# Altium schematic sheet Altimeter.SchDoc
size A4; SheetNumber: 1; SheetTotal: 1
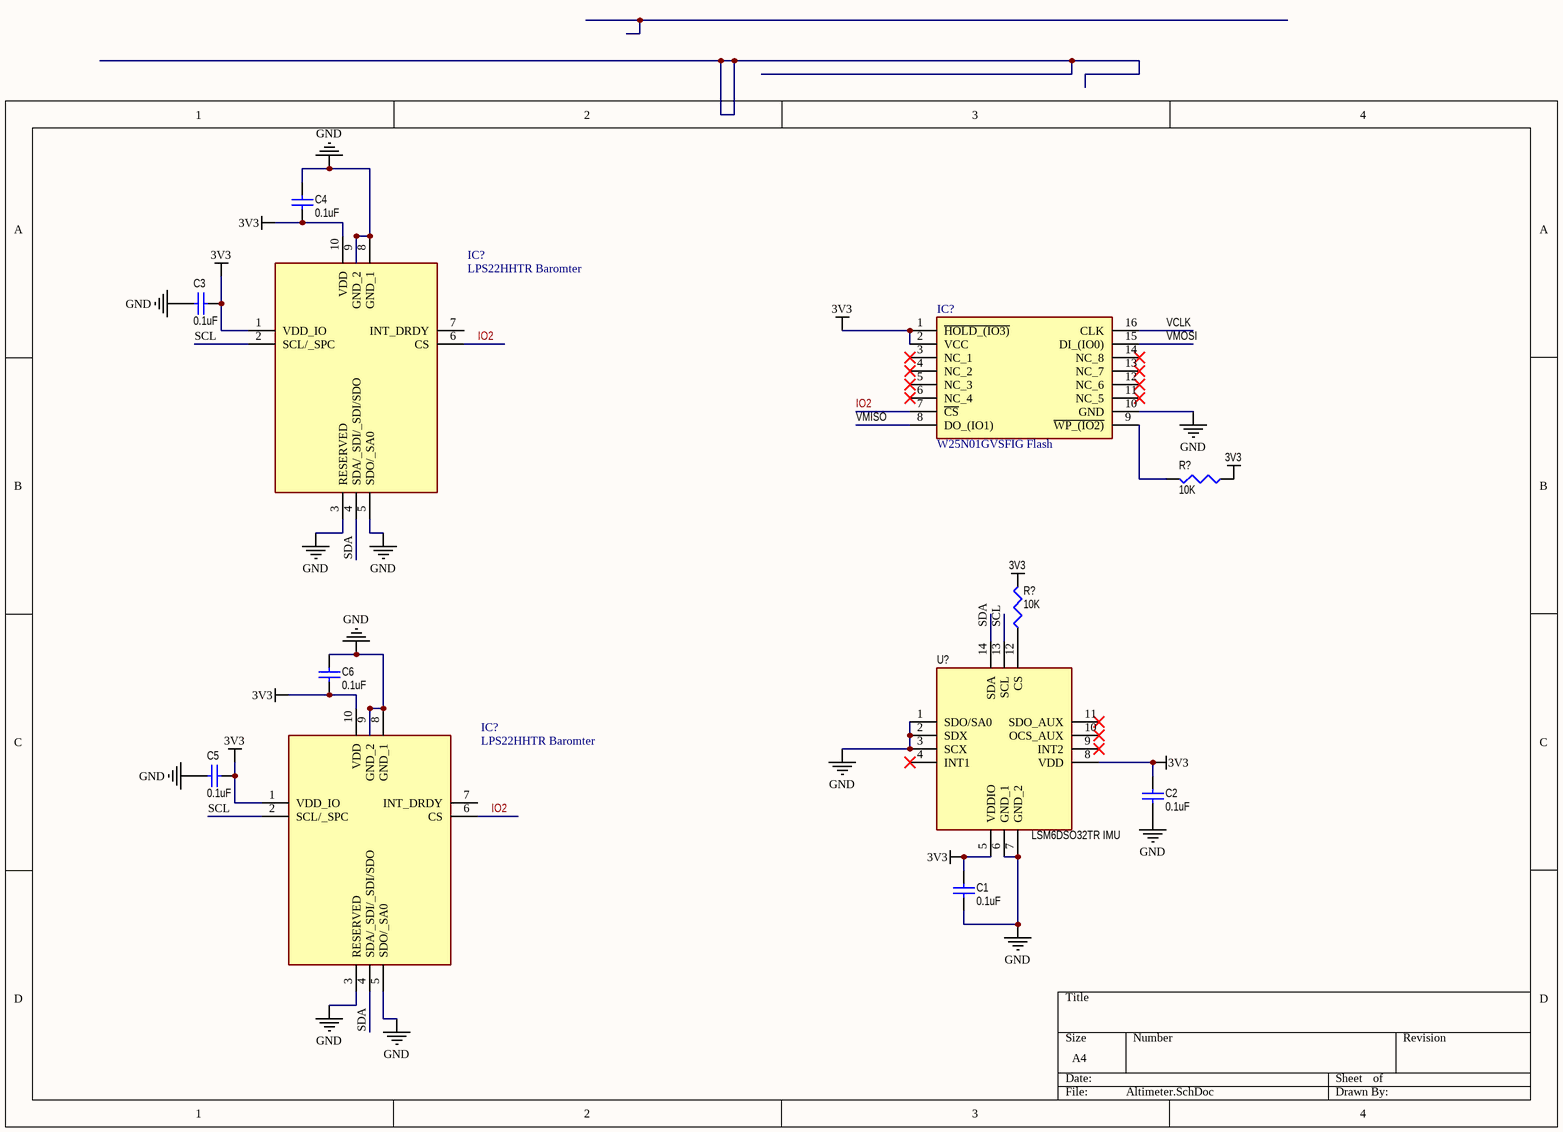
[diagram p0: Altimeter.SchDoc]

## Parts
(Parts that share a designator on the sheet are numbered #1, #2 ... from top to bottom, then left to right.)
C1  0.1uF  [1608[0603]]
C2  0.1uF  [1608[0603]]
C3  0.1uF  [1608[0603]]
C4  0.1uF  [1608[0603]]
C5  0.1uF  [1608[0603]]
C6  0.1uF  [1608[0603]]
IC?#1  LPS22HHTR Baromter  [LPS22HHTR]
IC?#2  W25N01GVSFIG Flash  [SOIC127P1032X264-16N]
IC?#3  LPS22HHTR Baromter  [LPS22HHTR]
R?#1  10K  [J1-0603]
R?#2  10K  [J1-0603]
U?  LSM6DSO32TR IMU  [LGA-14(2.5X3X0.86)]

## Nets
3V3: C1.2 C2.2 C3.2 C4.1 C5.1 C6.1 IC?#1.1(VDD_IO) IC?#1.10(VDD) IC?#2.1(~{HOLD_(IO3)}) IC?#2.2(VCC) IC?#3.1(VDD_IO) IC?#3.10(VDD) R?#1.1 U?.5(VDDIO) U?.8(VDD)
GND: C1.1 C2.1 C3.1 C4.2 C5.2 C6.2 IC?#1.3(RESERVED) IC?#1.5(SDO/_SA0) IC?#1.8(GND_1) IC?#1.9(GND_2) IC?#2.10(GND) IC?#3.3(RESERVED) IC?#3.5(SDO/_SA0) IC?#3.8(GND_1) IC?#3.9(GND_2) U?.1(SDO/SA0) U?.2(SDX) U?.3(SCX) U?.6(GND_1) U?.7(GND_2)
IO2: IC?#1.6(CS) IC?#2.7(~{CS}) IC?#3.6(CS)
SCL: IC?#1.2(SCL/_SPC) IC?#3.2(SCL/_SPC)
SDA: IC?#1.4(SDA/_SDI/_SDI/SDO) IC?#3.4(SDA/_SDI/_SDI/SDO)
VCLK: IC?#2.16(CLK)
VMISO: IC?#2.8(DO_(IO1))
VMOSI: IC?#2.15(DI_(IO0))
NetIC?#2_9: IC?#2.9(~{WP_(IO2)}) R?#1.2
NetR?#2_1: R?#2.1 U?.12(CS)

Not connected (* = marked no-connect by the designer): IC?#1 7(INT_DRDY); IC?#2 3(NC_1)* 4(NC_2)* 5(NC_3)* 6(NC_4)* 11(NC_5)* 12(NC_6)* 13(NC_7)* 14(NC_8)*; IC?#3 7(INT_DRDY); R?#2 2; U? 4(INT1)* 9(INT2)* 10(OCS_AUX)* 11(SDO_AUX)* 13(SCL) 14(SDA)

## Notes on the sheet
- SDA
- (near R?#2) SCL
- Labels drawn without touching a wire or pin: 3V3

## Library data of the parts
C1-C6 = Cap: Capacitor; Published: 8-Jun-2000; LatestRevisionDate: 17-Jul-2002; LatestRevisionNote: Re-released for DXP Platform.; PackageReference: RAD-0.3; Publisher: Altium Limited; PackageDescription: Radial Cap, Thru-Hole; 2 Leads; 0.3 in Pin Spacing; Value: 0.1uF
IC?#1 IC?#3 = LPS22HHTR: Integrated Circuit; Manufacturer_Name: STMicroelectronics; Datasheet Link: https://www.st.com/resource/en/datasheet/lps22hh.pdf; Height: 0.8mm; Manufacturer_Part_Number: LPS22HHTR; Mouser Part Number: 511-LPS22HHTR; Mouser Price/Stock: https://www.mouser.co.uk/ProductDetail/STMicroelectronics/LPS22HHTR?qs=lc2O%252BfHJPVbKAkJQGWFcLg%3D%3D; Arrow Part Number: LPS22HHTR; Arrow Price/Stock: https://www.arrow.com/en/products/lps22hhtr/stmicroelectronics?region=europe
IC?#2 = W25N01GVSFIG: Integrated Circuit; Manufacturer_Name: Winbond; Datasheet Link: https://www.winbond.com/hq/search-resource-file.jsp?partNo=W25N01GVSFIG&type=datasheet; Height: 2.64mm; Manufacturer_Part_Number: W25N01GVSFIG; Mouser Part Number: 454-W25N01GVSFIG; Mouser Price/Stock: https://www.mouser.co.uk/ProductDetail/Winbond/W25N01GVSFIG?qs=qSfuJ%252Bfl%2Fd5wRcUOkRc5Cw%3D%3D; Arrow Part Number: W25N01GVSFIG; Arrow Price/Stock: https://www.arrow.com/en/products/w25n01gvsfig/winbond-electronics?region=nac
R?#1 R?#2 = Res3: Resistor; Value: 1K; Published: 8-Jun-2000; LatestRevisionDate: 29-May-2009; LatestRevisionNote: IPC-7351 Footprint Added.; PackageReference: J1-0603; Publisher: Altium Limited; PackageDescription: Chip Resistor
U? = LSM6DSOTR: Accelerometer; Manufacturer_Name: STMicroelectronics; Datasheet Link: https://www.st.com/resource/en/datasheet/lsm6dso.pdf; Manufacturer_Part_Number: LSM6DSOTR; Mouser Part Number: 511-LSM6DSOTR; Mouser Price/Stock: https://www.mouser.co.uk/ProductDetail/STMicroelectronics/LSM6DSOTR?qs=lc2O%252BfHJPVbD197C5c7oNw%3D%3D; Arrow Part Number: LSM6DSOTR; Arrow Price/Stock: https://www.arrow.com/en/products/lsm6dsotr/stmicroelectronics